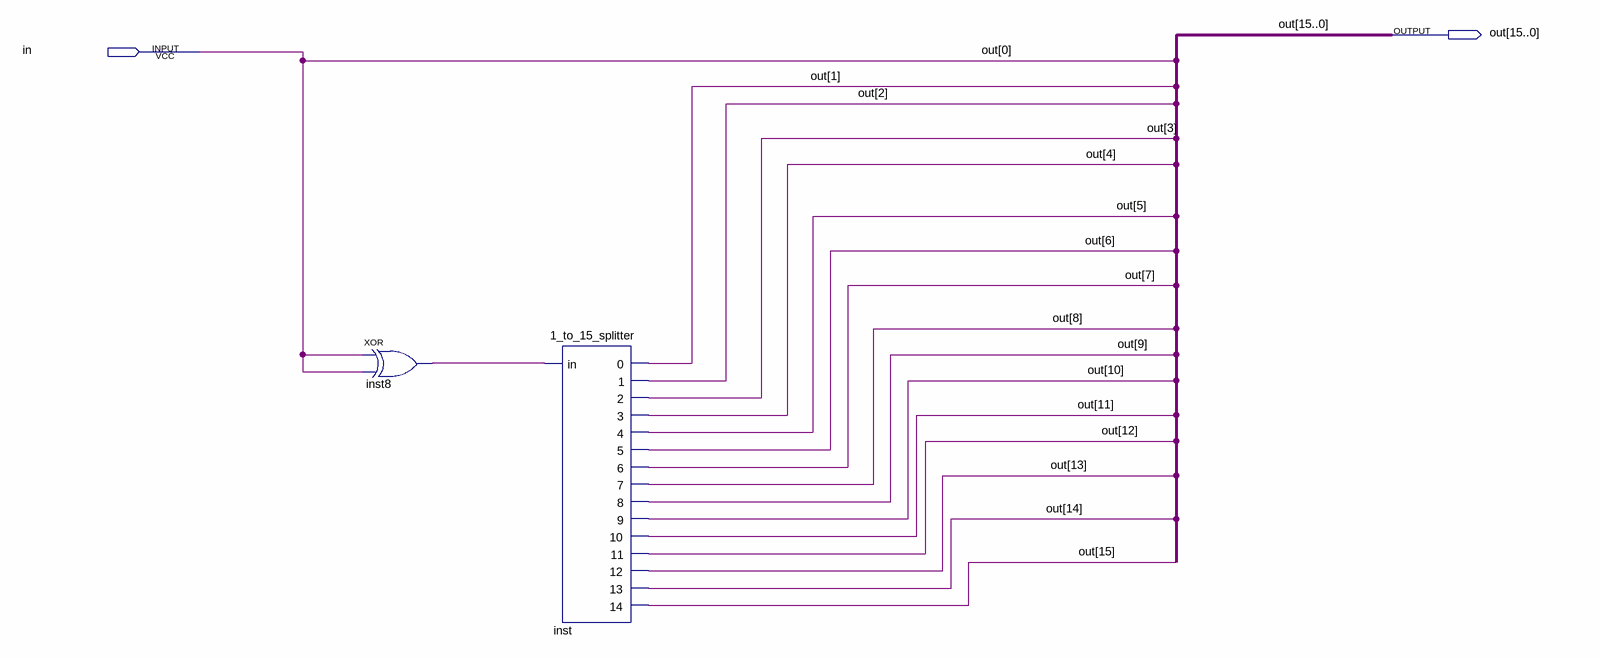
[diagram p0: schematic sheet]
// Quartus schematic Zero_One.bdf as structural Verilog: 2 symbols, 2 pins
module Zero_One (
  input  in,
  output [15:0] out
);

  wire inst8_out;

  xor inst8 (inst8_out, in, in);
  \1_to_15_splitter  inst (
    .in(inst8_out), .\0 (out[1]), .\1 (out[2]), .\2 (out[3]), .\3 (out[4]), .\4 (out[5]), .\5 (out[6]),
    .\6 (out[7]), .\7 (out[8]), .\8 (out[9]), .\9 (out[10]), .\10 (out[11]), .\11 (out[12]), .\12 (out[13]),
    .\13 (out[14]), .\14 (out[15]));

  assign out[0] = in;
endmodule
